# EAGLE design psu_2 (EAGLE 7.4.0)
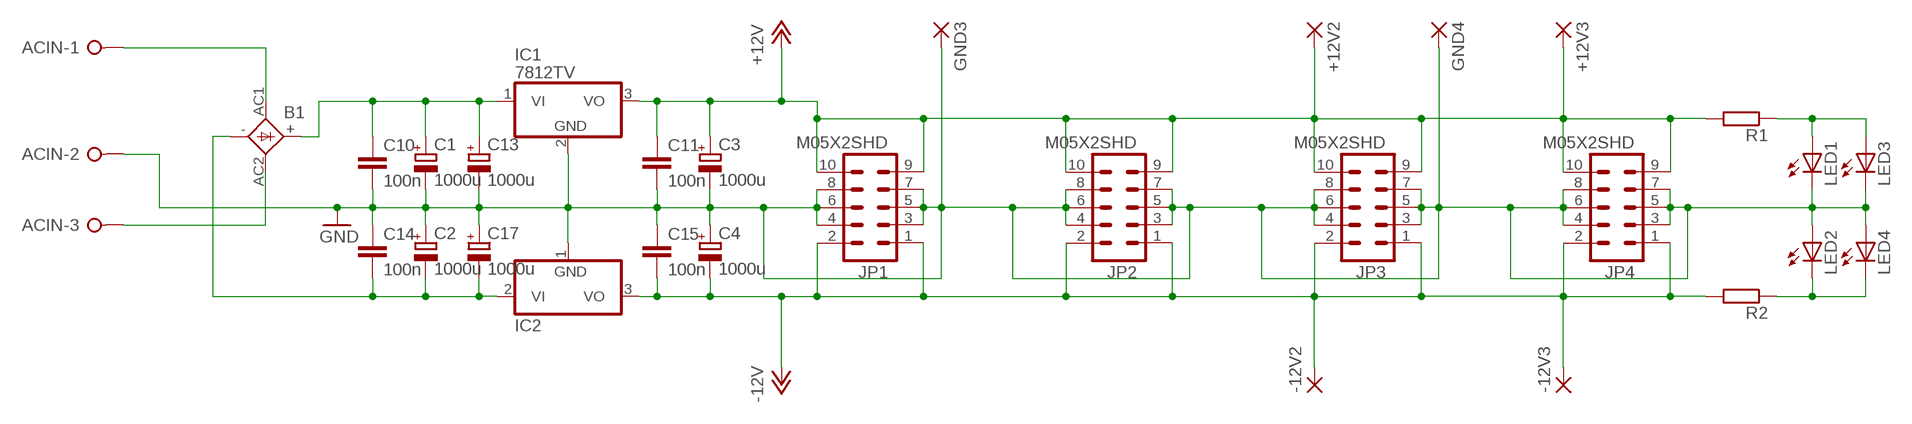
[diagram p0: schematic, sheet 1]

## Parts
+12V2  2,54/1,0  [2,54/1,0]
+12V3  2,54/1,0  [2,54/1,0]
-12V2  2,54/1,0  [2,54/1,0]
-12V3  2,54/1,0  [2,54/1,0]
ACIN  W237-3E  [W237-3E]
B1  2KBP  [2KBP]
C1  1000u  CPOL-EUE3.5-10  [E3,5-10]
C2  1000u  CPOL-EUE3.5-10  [E3,5-10]
C3  1000u  CPOL-EUE3.5-10  [E3,5-10]
C4  1000u  CPOL-EUE3.5-10  [E3,5-10]
C10  100n  C-EUC1206K  [C1206K]
C11  100n  C-EUC1206K  [C1206K]
C13  1000u  CPOL-EUE3.5-10  [E3,5-10]
C14  100n  C-EUC1206K  [C1206K]
C15  100n  C-EUC1206K  [C1206K]
C17  1000u  CPOL-EUE3.5-10  [E3,5-10]
GND3  2,54/1,0  [2,54/1,0]
GND4  2,54/1,0  [2,54/1,0]
IC1  7812TV  [TO220V]
IC2  7912TV  [TO220V]
JP1  M05X2SHD  [2X5-SHROUDED]
JP2  M05X2SHD  [2X5-SHROUDED]
JP3  M05X2SHD  [2X5-SHROUDED]
JP4  M05X2SHD  [2X5-SHROUDED]
LED1  LED3MM  [LED3MM]
LED2  LED3MM  [LED3MM]
LED3  LEDCHIPLED_1206  [CHIPLED_1206]
LED4  LEDCHIPLED_1206  [CHIPLED_1206]
R1  R-EU_M1206  [M1206]
R2  R-EU_M1206  [M1206]

## Nets
+12V: +12V2.1(P) +12V3.1(P) C3.+ C11.1 IC1.3(VO) JP1.9 JP1.10 JP2.9 JP2.10 JP3.9 JP3.10 JP4.9 JP4.10 R1.2
-12V: -12V2.1(P) -12V3.1(P) C4.- C15.2 IC2.3(VO) JP1.1 JP1.2 JP2.1 JP2.2 JP3.1 JP3.2 JP4.1 JP4.2 R2.2
GND: ACIN.2 C1.- C2.+ C3.- C4.+ C10.2 C11.2 C13.- C14.1 C15.1 C17.+ GND3.1(P) GND4.1(P) IC1.2(GND) IC2.1(GND) JP1.3 JP1.4 JP1.5 JP1.6 JP1.7 JP1.8 JP2.3 JP2.4 JP2.5 JP2.6 JP2.7 JP2.8 JP3.3 JP3.4 JP3.5 JP3.6 JP3.7 JP3.8 JP4.3 JP4.4 JP4.5 JP4.6 JP4.7 JP4.8 LED1.K(C) LED2.A LED3.C LED4.A
N$1: LED2.K(C) LED4.C R2.1
N$2: LED1.A LED3.A R1.1
N$3: B1.- C2.- C14.2 C17.- IC2.2(VI)
N$4: B1.+ C1.+ C10.1 C13.+ IC1.1(VI)
N$5: ACIN.1 B1.AC1
N$6: ACIN.3 B1.AC2

## Library data of the parts
+12V2 +12V3 -12V2 -12V3 GND3 GND4 = wirepad:2,54/1,0: THROUGH-HOLE PAD
ACIN = con-wago-508:W237-3E: WAGO SREW CLAMP; OC_FARNELL: unknown; OC_NEWARK: unknown
B1 = rectifier:2KBP: RECTIFIER grid 3 x 3,81 mm
C1-C4 C13 C17 = rcl:CPOL-EU: POLARIZED CAPACITOR, European symbol
C10 C11 C14 C15 = rcl:C-EU: CAPACITOR, European symbol
IC1 = cavalier:78*: Positive VOLTAGE REGULATOR Source: http://cache.national.com/ds/LM/LM78L05.pdf http://www.fairchildsemi.com/ds/LM/LM7805.pdf
IC2 = cavalier:79*: Negative VOLTAGE REGULATOR
JP1-JP4 = SparkFun:M05X2: Header 5x2 Standard 10-pin dual row 0.1" header. Commonly used with AVR-ISP. Use with Spark Fun Electronics SKU: PRT-00778
LED1-LED4 = led:LED: LED OSRAM: - CHIPLED LG R971, LG N971, LY N971, LG Q971, LY Q971, LO R971, LY R971 LH N974, LH R974 LS Q976, LO Q976, LY Q976 LO Q996 - Hyper CHIPLED LW Q18S LB Q993, LB Q99A, LB R99A - SideLED LS A670, LO A670, LY A670, LG A670, LP A670 LB A673, LV A673, LT A673, LW A673 LH A674 LY A675 LS A676, LA A676, LO A676, LY A676, LW A676 LS A679, LY A679, LG A679 - Hyper Micro SIDELED® LS Y876, LA Y876, LO Y876, LY Y876 LT Y87S - SmartLED LW L88C, LW L88S LB L89C, LB L89S, LG L890 LS L89K, LO L89K, LY L89K LS L896, LA L896, LO L896, LY L896 - TOPLED LS T670, LO T670, LY T670, LG T670, LP T670 LSG T670, LSP T670, LSY T670, LOP T670, LYG T670 LG T671, LOG T671, LSG T671 LB T673, LV T673, LT T673, LW T673 LH T674 LS T676, LA T676, LO T676, LY T676, LB T676, LH T676, LSB T676, LW T676 LB T67C, LV T67C, LT T67C, LS T67K, LO T67K, LY T67K, LW E67C LS E67B, LA E67B, LO E67B, LY E67B, LB E67C, LV E67C, LT E67C LW T67C LS T679, LY T679, LG T679 LS T770, LO T770, LY T770, LG T770, LP T770 LB T773, LV T773, LT T773, LW T773 LH T774 LS E675, LA E675, LY E675, LS T675 LS T776, LA T776, LO T776, LY T776, LB T776 LHGB T686 LT T68C, LB T68C - Hyper Mini TOPLED® LB M676 - Mini TOPLED Santana® LG M470 LS M47K, LO M47K, LY M47K Source: http://www.osram.convergy.de LUXEON: - LUMILED® LXK2-PW12-R00, LXK2-PW12-S00, LXK2-PW14-U00, LXK2-PW14-V00 LXK2-PM12-R00, LXK2-PM12-S00, LXK2-PM14-U00 LXK2-PE12-Q00, LXK2-PE12-R00, LXK2-PE12-S00, LXK2-PE14-T00, LXK2-PE14-U00 LXK2-PB12-K00, LXK2-PB12-L00, LXK2-PB12-M00, LXK2-PB14-N00, LXK2-PB14-P00, LXK2-PB14-Q00 LXK2-PR12-L00, LXK2-PR12-M00, LXK2-PR14-Q00, LXK2-PR14-R00 LXK2-PD12-Q00, LXK2-PD12-R00, LXK2-PD12-S00 LXK2-PH12-R00, LXK2-PH12-S00 LXK2-PL12-P00, LXK2-PL12-Q00, LXK2-PL12-R00 Source: www.luxeon.com KINGBRIGHT: KA-3528ASYC Source: www.kingbright.com
R1 R2 = rcl:R-EU_: RESISTOR, European symbol

## Board
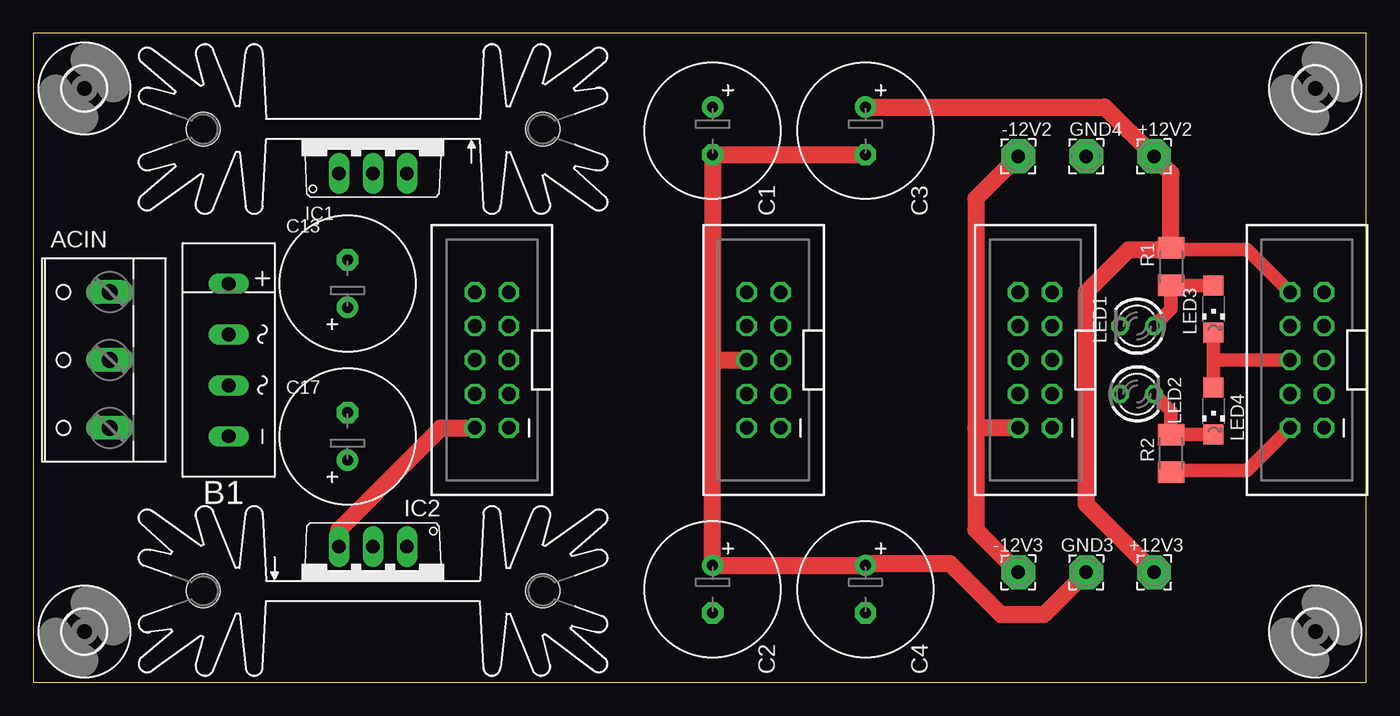
[diagram p1: board, top side]
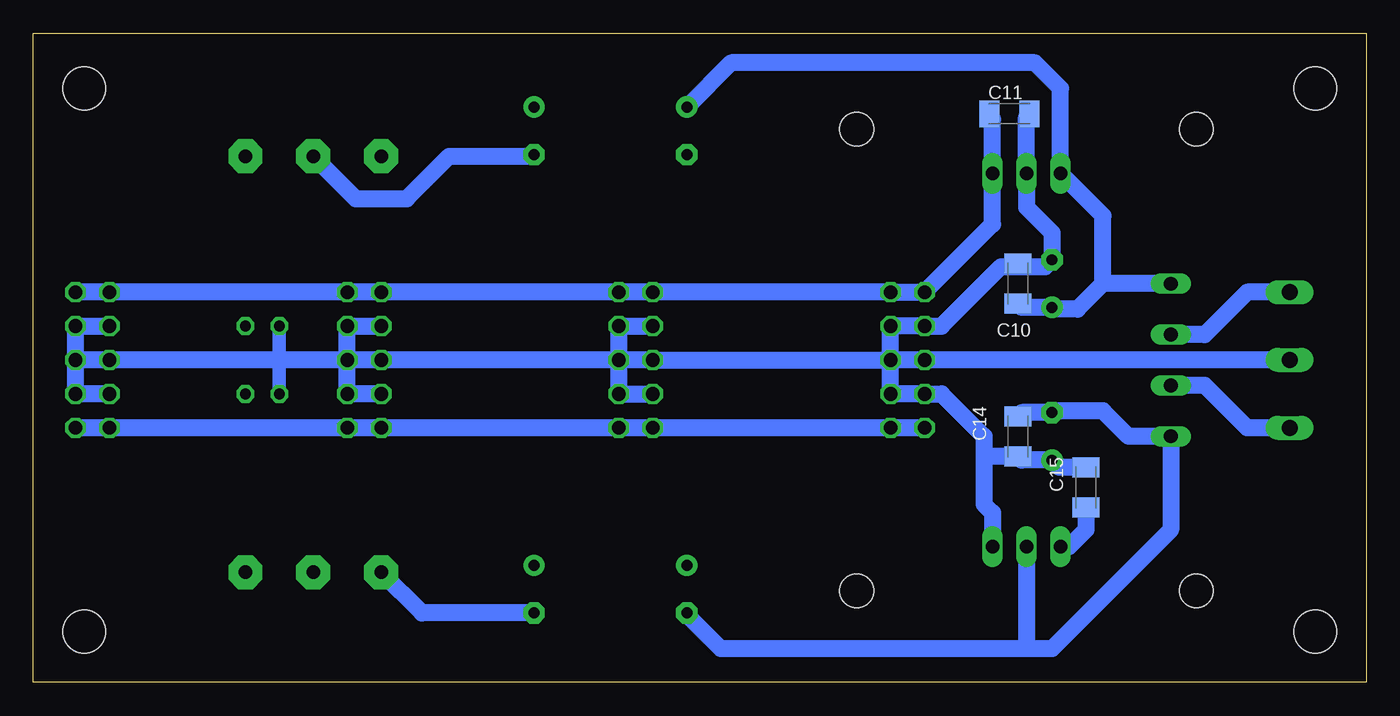
[diagram p2: board, bottom side, seen from below]

Size 99.67 x 48.56 mm. Coordinates in mm from the lower left corner, seen from the top.
Outline: 0,0 99.67,0 99.67,48.56 0,48.56 0,0
Copper layers (1*16): Top 0.035mm / dielectric 1.5mm / Bottom 0.035mm
Design rules "default": minimum track width 10mil, minimum drill 24mil, track to track 8mil, track to pad 8mil, pad to pad 8mil, via to via 8mil, smd to smd 8mil, copper to edge 40mil, drill to drill 8mil, minimum pad ring 10mil, minimum via ring 8mil, stop-mask expansion 4mil, vias tented up to drill 0mil, thermal gap 10mil

### Footprints (pad centres in the part's own frame; a part is rotated, then mirrored left to right if it is on the bottom)
2,54/1,0 = drill 1.016 pad 2.54 octagon: 1 0,0
W237-3E = drill 1.194 long: 1 -5.08,-0.635; 2 0,-0.635; 3 5.08,-0.635
2KBP = drill 1.016 long: + 5.715,0; - -5.715,0; AC1 -1.905,0; AC2 1.905,0
E3,5-10 = drill 0.813 pad 1.6: + -1.778,0 | drill 0.813 pad 1.6 octagon: - 1.778,0
C1206K = smd 1.5 x 2: 1 -1.5,0; 2 1.5,0
TO220V = drill 1.016 long: 1 -2.54,-2.54; 2 0,-2.54; 3 2.54,-2.54
2X5-SHROUDED = drill 1.016 octagon: 1 -1.27,5.08; 2 1.27,5.08; 3 -1.27,2.54; 4 1.27,2.54; 5 -1.27,0; 6 1.27,0; 7 -1.27,-2.54; 8 1.27,-2.54; 9 -1.27,-5.08; 10 1.27,-5.08
LED3MM = drill 0.813 octagon: A -1.27,0; K 1.27,0
CHIPLED_1206 = smd 1.5 x 1.5: A 0,-1.75; C 0,1.75
M1206 = smd 1.6 x 2: 1 -1.4,0; 2 1.4,0
3,2 = hole 3.2: 0,0
SK104 = hole 2.54: -12.7,-0.762; 12.7,-0.762

### Placement (x,y rotation side)
+12V2  83.82,39.37 0 top
+12V3  83.82,8.26 0 top
-12V2  73.66,39.37 0 top
-12V3  73.66,8.26 0 top
ACIN  5.08,24.13 90 top
B1  14.61,24.13 90 top
C1  50.8,41.27 270 top
C2  50.8,6.99 270 top
C3  62.23,41.27 270 top
C4  62.23,6.99 270 top
C10  26.04,29.84 90 bottom
C11  26.67,42.55 0 bottom
C13  23.5,29.84 90 top
C14  26.04,18.41 90 bottom
C15  20.95,14.61 270 bottom
C17  23.5,18.41 90 top
GND3  78.74,8.26 0 top
GND4  78.74,39.37 0 top
IC1  25.4,40.64 0 top
IC2  25.4,7.62 180 top
JP1  34.29,24.13 180 top
JP2  54.61,24.13 180 top
JP3  74.93,24.13 180 top
JP4  95.25,24.13 180 top
LED1  82.55,26.67 180 top
LED2  82.55,21.59 0 top
LED3  88.27,27.94 180 top
LED4  88.27,20.32 180 top
R1  85.09,31.11 90 top
R2  85.09,17.14 270 top
U$1  [3,2]  3.81,3.81 0 top
U$2  [3,2]  95.89,3.81 0 top
U$3  [3,2]  3.81,44.45 0 top
U$4  [3,2]  95.89,44.45 0 top
U$5  [SK104]  25.4,40.64 180 top
U$7  [SK104]  25.4,7.62 0 top

### Tracks (layer width: path | path; a pad name or v marks a point on that pad's centre or on a via)
+12V
  Top 1.016: JP4.10 90.81,32.38 84.58,32.38 R1.2
  Top 1.27: R1.2 85.09,38.1 +12V2.1 80.14,43.05 C3.+ | +12V3.1 78.74,13.34 78.74,29.21 81.92,32.38 84.58,32.38
  Bottom 1.27: JP4.9 JP4.10 JP3.9 JP3.10 JP2.9 JP2.10 JP1.9 JP1.10 27.94,34.29 IC1.3 27.94,42.14 C11.1
-12V
  Top 1.016: JP4.2 90.81,15.88 84.58,15.88 R2.2
  Top 1.27: -12V2.1 70.48,36.2 70.48,19.05 | 70.48,19.05 70.48,11.43 -12V3.1 | JP3.2 70.48,19.05 | IC2.3 22.86,11.43 30.48,19.05 JP1.2
  Bottom 1.27: JP1.2 JP1.1 JP2.2 JP2.1 JP3.2 JP3.1 JP4.2 JP4.1 | C15.2 20.95,11.43 22.23,10.16 IC2.3 | C4.- 70.61,5.21 -12V3.1
GND
  Top 1.016: 88.27,24.13 JP4.6 | LED3.C 88.27,24.13 | LED4.A 88.27,24.13
  Top 1.27: 50.8,24.13 C1.- C3.- | 50.8,24.13 JP2.6 | 50.8,24.13 C2.+ C4.+ 62.36,8.89 68.58,8.89 72.39,5.08 75.56,5.08 GND3.1
  Bottom 1.016: LED1.K 81.28,24.13 LED2.A
  Bottom 1.27: ACIN.2 JP1.6 JP1.5 | JP1.5 JP1.3 JP1.4 31.75,21.59 28.57,18.41 28.57,17.14 | JP1.5 JP1.7 JP1.8 31.75,26.67 27.3,31.11 26.67,31.11 | JP1.5 JP2.6 JP2.5 | JP2.4 JP2.3 JP2.5 | JP2.8 JP2.7 JP2.5 | JP2.5 JP3.6 JP3.5 | JP3.4 JP3.3 JP3.5 | JP3.5 JP3.7 JP3.8 | JP3.5 81.28,24.13 JP4.6 JP4.5 | JP4.4 JP4.3 JP4.5 | JP4.5 JP4.7 JP4.8 | C15.1 22.96,16.11 C17.+ 25.76,16.64 C14.1 28.34,16.91 28.57,17.14 | 28.57,17.14 28.57,13.34 27.94,12.7 IC2.1 | 26.67,31.11 24,31.11 C13.- 23.5,33.66 25.4,35.56 IC1.2 25.4,42.31 C11.2 | C10.2 26.44,31.34 26.67,31.11 | GND4.1 75.56,36.2 71.75,36.2 68.58,39.37 62.36,39.37 C3.-
N$1
  Top 1.016: LED4.C 85.7,18.57 85.06,18.55 R2.1 85.09,20.32 LED2.K
N$2
  Top 1.016: LED1.A 85.09,27.94 R1.1 88.24,29.71 LED3.A
N$3
  Bottom 1.27: C2.- 50.8,5.08 48.26,2.54 25.4,2.54 | 25.4,2.54 23.5,2.54 14.61,11.43 B1.- 17.78,18.41 19.68,20.32 23.37,20.32 C17.- 25.76,20.19 C14.2 | IC2.2 25.4,2.54
N$4
  Bottom 1.27: B1.+ 19.68,29.84 | 19.68,29.84 19.68,34.92 IC1.1 22.86,44.45 24.77,46.35 47.5,46.35 C1.+ | 19.68,29.84 21.59,27.94 23.37,27.94 C13.+ 25.76,28.07 C10.1
N$5
  Bottom 1.27: ACIN.1 8.89,19.05 12.06,22.23 B1.AC1
N$6
  Bottom 1.27: ACIN.3 8.89,29.21 12.06,26.04 B1.AC2